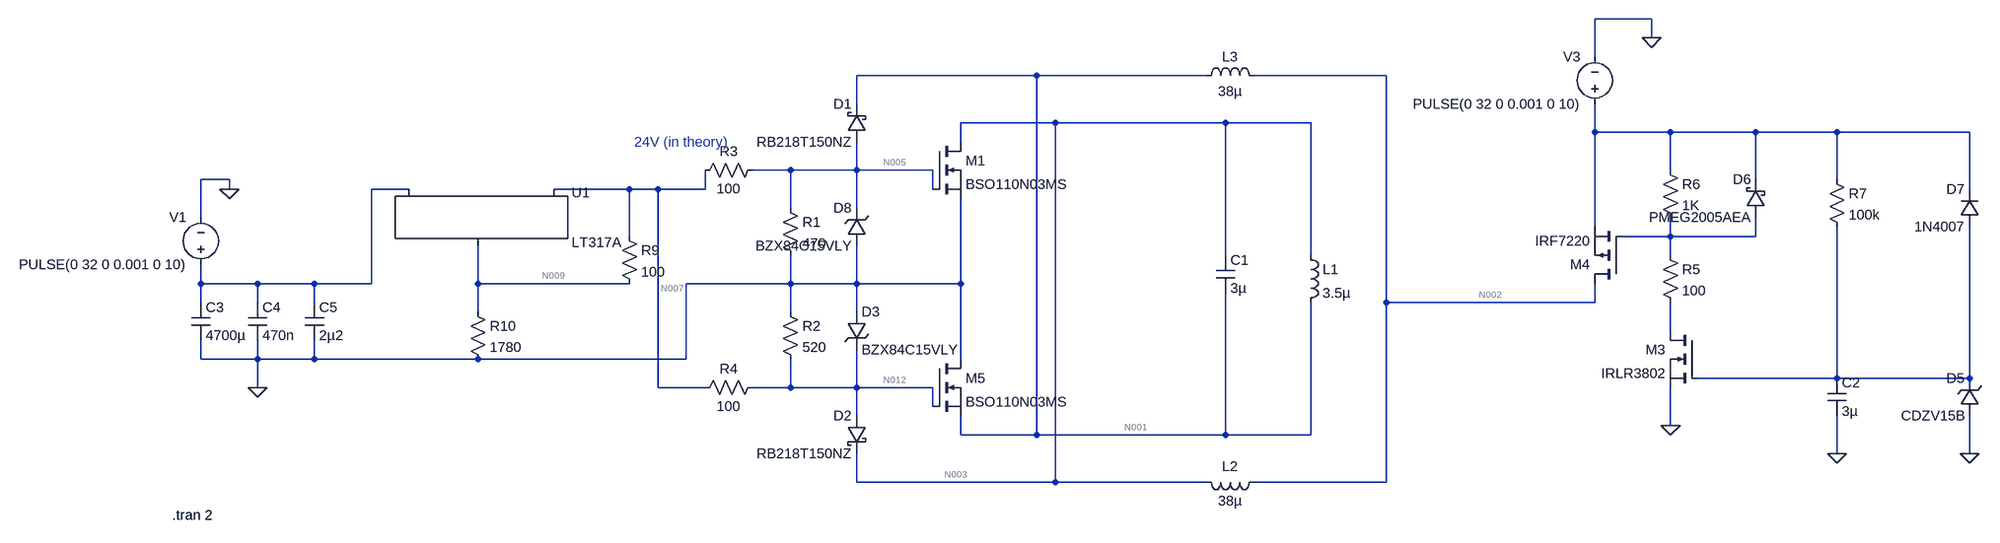
[diagram p0: schematic combined.asc]
combined.asc, the LTspice schematic file:
Version 4
SHEET 1 1608 680
WIRE 864 -256 768 -256
WIRE 864 -224 864 -256
WIRE 768 -192 768 -256
WIRE -192 -160 -496 -160
WIRE 112 -160 -192 -160
WIRE 416 -160 192 -160
WIRE -496 -112 -496 -160
WIRE -160 -80 -320 -80
WIRE 144 -80 -160 -80
WIRE 288 -80 144 -80
WIRE 768 -64 768 -112
WIRE 896 -64 768 -64
WIRE 1040 -64 896 -64
WIRE 1184 -64 1040 -64
WIRE 1408 -64 1184 -64
WIRE -320 -48 -320 -80
WIRE -608 0 -672 0
WIRE -496 0 -496 -48
WIRE -496 0 -608 0
WIRE -368 0 -496 0
WIRE 896 0 896 -64
WIRE -1568 16 -1616 16
WIRE 1040 16 1040 -64
WIRE 1184 16 1184 -64
WIRE -1568 32 -1568 16
WIRE -1264 32 -1328 32
WIRE -880 32 -1008 32
WIRE -832 32 -880 32
WIRE -752 32 -752 0
WIRE -752 32 -832 32
WIRE -368 32 -368 0
WIRE 1408 32 1408 -64
WIRE -608 64 -608 0
WIRE -496 64 -496 0
WIRE -1616 80 -1616 16
WIRE 768 96 768 -64
WIRE -880 112 -880 32
WIRE 896 112 896 80
WIRE 896 112 816 112
WIRE 1040 112 1040 80
WIRE 1040 112 896 112
WIRE 144 144 144 -80
WIRE 288 144 288 -80
WIRE 896 144 896 112
WIRE -1616 192 -1616 160
WIRE -1520 192 -1616 192
WIRE -1424 192 -1520 192
WIRE -1328 192 -1328 32
WIRE -1328 192 -1424 192
WIRE -1136 192 -1136 128
WIRE -880 192 -1136 192
WIRE -608 192 -608 144
WIRE -608 192 -784 192
WIRE -496 192 -496 128
WIRE -496 192 -608 192
WIRE -320 192 -320 48
WIRE -320 192 -496 192
WIRE -1616 224 -1616 192
WIRE -1520 224 -1520 192
WIRE -1424 224 -1424 192
WIRE 416 224 416 -160
WIRE 768 224 768 192
WIRE 768 224 416 224
WIRE -1136 240 -1136 192
WIRE -608 240 -608 192
WIRE -496 240 -496 192
WIRE 896 272 896 224
WIRE -1616 320 -1616 288
WIRE -1520 320 -1520 288
WIRE -1520 320 -1616 320
WIRE -1424 320 -1424 288
WIRE -1424 320 -1520 320
WIRE -1136 320 -1424 320
WIRE -784 320 -784 192
WIRE -784 320 -1136 320
WIRE -320 320 -320 192
WIRE 1184 352 1184 96
WIRE 1184 352 944 352
WIRE 1408 352 1408 96
WIRE 1408 352 1184 352
WIRE -1520 368 -1520 320
WIRE -832 368 -832 32
WIRE -752 368 -832 368
WIRE -608 368 -608 320
WIRE -608 368 -672 368
WIRE -496 368 -496 304
WIRE -496 368 -608 368
WIRE -368 368 -496 368
WIRE -368 400 -368 368
WIRE -496 416 -496 368
WIRE 896 432 896 368
WIRE -320 448 -320 416
WIRE -192 448 -192 -160
WIRE -192 448 -320 448
WIRE 144 448 144 208
WIRE 144 448 -192 448
WIRE 288 448 288 224
WIRE 288 448 144 448
WIRE 1184 480 1184 416
WIRE 1408 480 1408 416
WIRE -496 528 -496 480
WIRE -160 528 -160 -80
WIRE -160 528 -496 528
WIRE 112 528 -160 528
WIRE 416 528 416 224
WIRE 416 528 192 528
FLAG 896 432 0
FLAG 1184 480 0
FLAG 1408 480 0
FLAG -1568 32 0
FLAG -1520 368 0
FLAG 864 -224 0
SYMBOL cap 128 144 R0
SYMATTR InstName C1
SYMATTR Value 3µ
SYMBOL ind 272 128 R0
SYMATTR InstName L1
SYMATTR Value 3.5µ
SYMBOL ind 208 512 R90
WINDOW 0 5 56 VBottom 2
WINDOW 3 32 56 VTop 2
SYMATTR InstName L2
SYMATTR Value 38µ
SYMBOL ind 96 -144 R270
WINDOW 0 32 56 VTop 2
WINDOW 3 5 56 VBottom 2
SYMATTR InstName L3
SYMATTR Value 38µ
SYMBOL nmos -368 -48 R0
SYMATTR InstName M1
SYMATTR Value BSO110N03MS
SYMBOL schottky -480 -48 R180
WINDOW 0 24 64 Left 2
WINDOW 3 24 0 Left 2
SYMATTR InstName D1
SYMATTR Value RB218T150NZ
SYMATTR Description Diode
SYMATTR Type diode
SYMBOL res -624 48 R0
SYMATTR InstName R1
SYMATTR Value 470
SYMBOL res -624 224 R0
SYMATTR InstName R2
SYMATTR Value 520
SYMBOL res -656 -16 R90
WINDOW 0 0 56 VBottom 2
WINDOW 3 32 56 VTop 2
SYMATTR InstName R3
SYMATTR Value 100
SYMBOL res -656 352 R90
WINDOW 0 0 56 VBottom 2
WINDOW 3 32 56 VTop 2
SYMATTR InstName R4
SYMATTR Value 100
SYMBOL cap 1168 352 R0
SYMATTR InstName C2
SYMATTR Value 3µ
SYMATTR SpiceLine V=50 Irms=10.2 Rser=0.027 Lser=0
SYMBOL zener 1424 416 R180
WINDOW 0 24 64 Left 2
WINDOW 3 24 0 Left 2
SYMATTR InstName D5
SYMATTR Value CDZV15B
SYMATTR Description Diode
SYMATTR Type diode
SYMBOL nmos 944 272 M0
SYMATTR InstName M3
SYMATTR Value IRLR3802
SYMBOL res 880 128 R0
SYMATTR InstName R5
SYMATTR Value 100
SYMATTR SpiceLine tol=1 pwr=0.1
SYMBOL res 880 -16 R0
SYMATTR InstName R6
SYMATTR Value 1K
SYMATTR SpiceLine tol=1 pwr=0.1
SYMBOL schottky 1056 80 R180
WINDOW 0 24 64 Left 2
WINDOW 3 24 0 Left 2
SYMATTR InstName D6
SYMATTR Value PMEG2005AEA
SYMATTR Description Diode
SYMATTR Type diode
SYMBOL res 1168 0 R0
SYMATTR InstName R7
SYMATTR Value 100k
SYMATTR SpiceLine tol=1 pwr=0.1
SYMBOL diode 1424 96 R180
WINDOW 0 24 64 Left 2
WINDOW 3 24 0 Left 2
SYMATTR InstName D7
SYMATTR Value 1N4007
SYMBOL pmos 816 192 R180
SYMATTR InstName M4
SYMATTR Value IRF7220
SYMBOL cap -1632 224 R0
SYMATTR InstName C3
SYMATTR Value 4700µ
SYMBOL cap -1536 224 R0
SYMATTR InstName C4
SYMATTR Value 470n
SYMBOL cap -1440 224 R0
SYMATTR InstName C5
SYMATTR Value 2µ2
SYMBOL res -896 96 R0
SYMATTR InstName R9
SYMATTR Value 100
SYMBOL PowerProducts\\LT317A -1136 32 R0
SYMATTR InstName U1
SYMBOL res -1152 224 R0
SYMATTR InstName R10
SYMATTR Value 1780
SYMBOL nmos -368 320 R0
SYMATTR InstName M5
SYMATTR Value BSO110N03MS
SYMBOL voltage 768 -96 R180
WINDOW 0 24 96 Left 2
WINDOW 3 24 16 Left 2
WINDOW 123 0 0 Left 0
WINDOW 39 0 0 Left 0
SYMATTR InstName V3
SYMATTR Value PULSE(0 32 0 0.001 0 10)
SYMBOL voltage -1616 176 R180
WINDOW 0 24 96 Left 2
WINDOW 3 24 16 Left 2
WINDOW 123 0 0 Left 0
WINDOW 39 0 0 Left 0
SYMATTR InstName V1
SYMATTR Value PULSE(0 32 0 0.001 0 10)
SYMBOL schottky -480 416 M0
SYMATTR InstName D2
SYMATTR Value RB218T150NZ
SYMATTR Description Diode
SYMATTR Type diode
SYMBOL zener -480 128 R180
WINDOW 0 24 64 Left 2
WINDOW 3 24 0 Left 2
SYMATTR InstName D8
SYMATTR Value BZX84C15VLY
SYMATTR Description Diode
SYMATTR Type diode
SYMBOL zener -512 240 R0
SYMATTR InstName D3
SYMATTR Value BZX84C15VLY
SYMATTR Description Diode
SYMATTR Type diode
TEXT -872 -48 Left 2 ;24V (in theory)
TEXT -1664 584 Left 2 !.tran 2

The netlist it stands for:
* combined.asc
C1 N003 N001 3µ
L1 N003 N001 3.5µ
L2 N002 N003 38µ
L3 N001 N002 38µ
M1 N003 N005 0 0 BSO110N03MS
D1 N005 N001 RB218T150NZ
R1 N005 0 470
R2 0 N012 520
R3 N005 N007 100
R4 N012 N007 100
C2 N011 0 3µ V=50 Irms=10.2 Rser=0.027 Lser=0
D5 0 N011 CDZV15B
M3 N010 N011 0 0 IRLR3802
R5 N008 N010 100 tol=1 pwr=0.1
R6 N004 N008 1K tol=1 pwr=0.1
D6 N008 N004 PMEG2005AEA
R7 N004 N011 100k tol=1 pwr=0.1
D7 N011 N004 1N4007
M4 N002 N008 N004 N004 IRF7220
C3 N006 0 4700µ
C4 N006 0 470n
C5 N006 0 2µ2
R9 N007 N009 100
XU1 N009 N007 N006 LT317A
R10 N009 0 1780
M5 0 N012 N001 N001 BSO110N03MS
V3 N004 0 PULSE(0 32 0 0.001 0 10)
V1 N006 0 PULSE(0 32 0 0.001 0 10)
D2 N012 N003 RB218T150NZ
D8 0 N005 BZX84C15VLY
D3 0 N012 BZX84C15VLY
.model D D
.lib standard.dio
.model NMOS NMOS
.model PMOS PMOS
.lib standard.mos
* 24V (in theory)
.tran 2
.lib LTC.lib
.backanno
.end

* Results of the author's LTspice run, read from the files saved beside the schematic
* Operating Point, zero values left out:
*   V(n003) = -1.081 nV
*   V(n001) = -1.081 nV
*   V(n002) = -1.081 nV
*   V(n005) = -619.2 nV
*   V(n012) = -629.8 nV
*   V(n007) = -751.2 nV
*   V(n009) = -711.2 nV
*   Id(M4) = -5.138 pA
*   Is(M4) = 5.138 pA
*   I(D1) = -2.547 pA
*   I(D2) = -2.591 pA
*   I(L2) = 2.576 pA
*   I(L3) = -2.562 pA
*   I(R1) = -1.317 nA
*   I(R2) = 1.211 nA
*   I(R3) = 1.32 nA
*   I(R4) = 1.214 nA
*   I(R9) = -399.6 pA
*   I(R10) = -399.6 pA
*   I(V3) = -5.138 pA
*   I(V1) = 2.933 nA
*   Ix(u1:2) = 2.933 nA
*   Ix(u1:3) = -2.933 nA
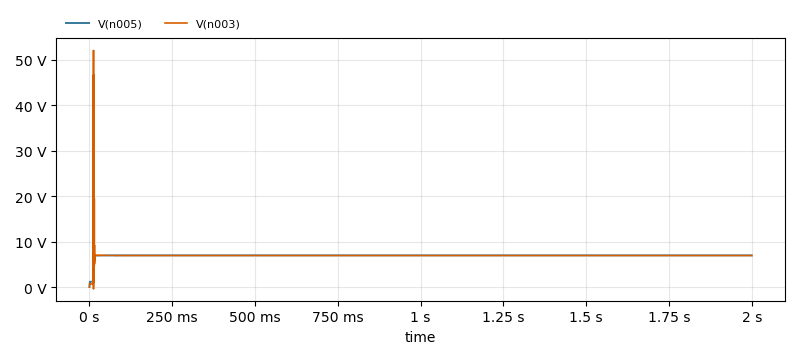
[diagram p1: Transient Analysis of combined.asc, plotted from the saved traces]
* Transient Analysis, 1 run:
*   V(n005): min 0 V, max 6.976 V, average 6.938 V, rms 6.953 V, last 6.976 V
*   V(n003): min -381.3 mV, max 52.11 V, average 6.906 V, rms 6.927 V, last 6.944 V